# EAGLE design PiDGC (EAGLE 9.6.2)
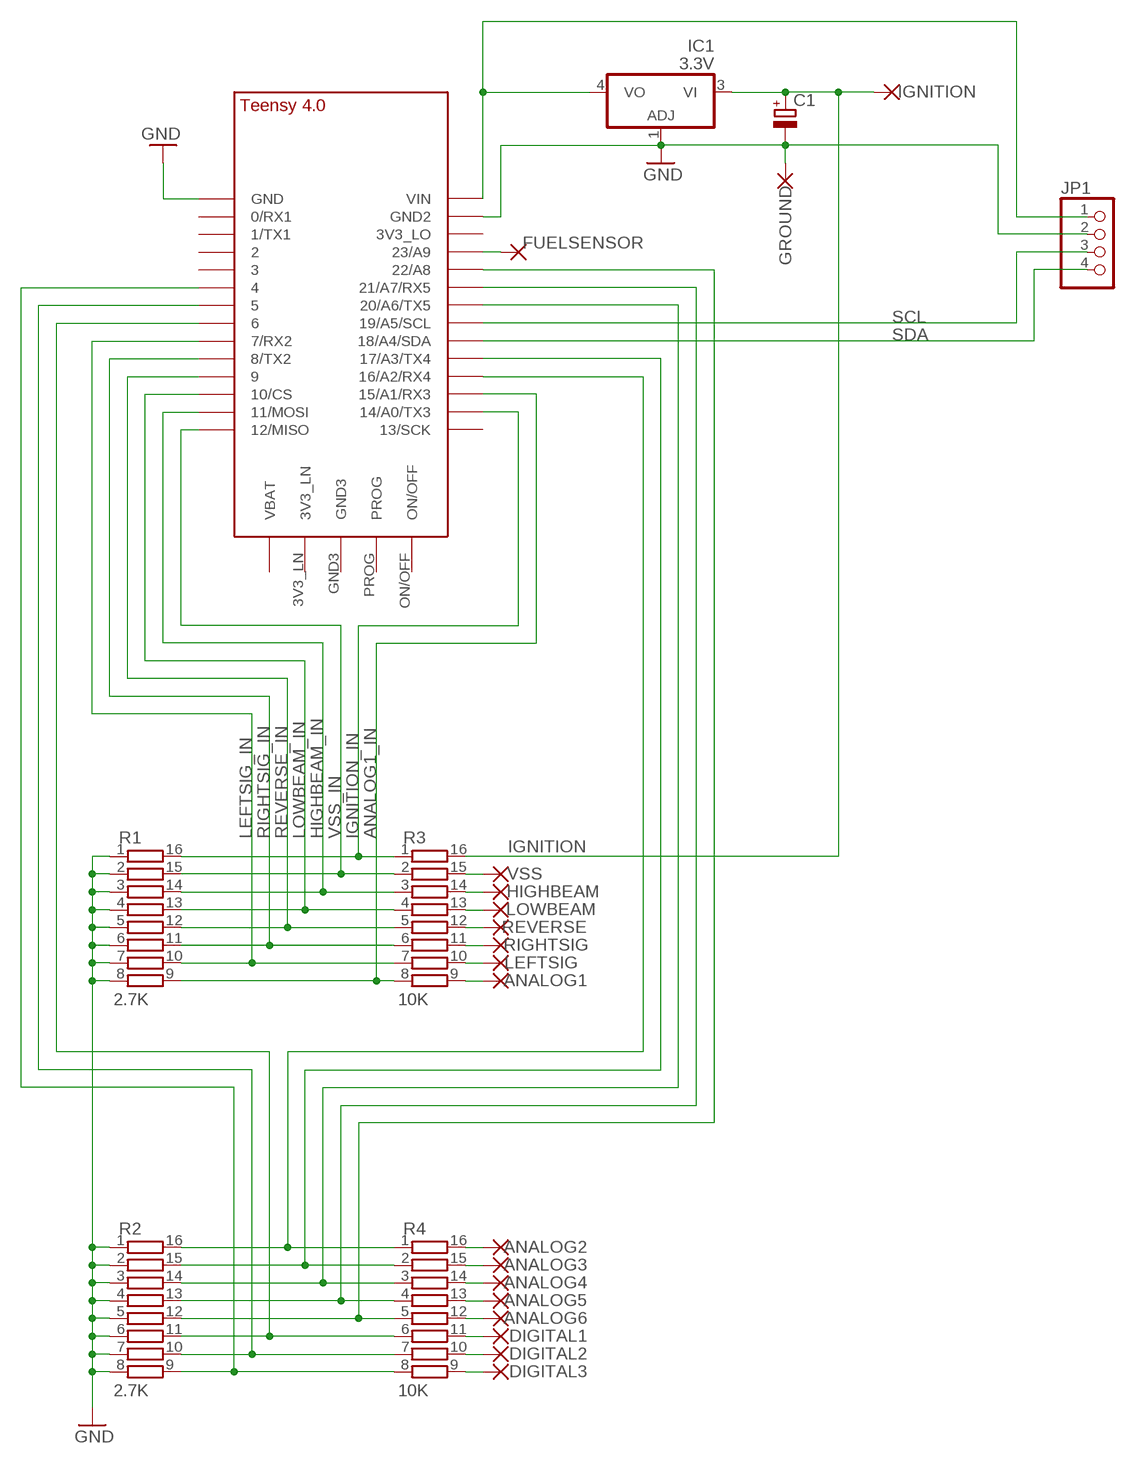
[diagram p0: schematic, sheet 1]

## Parts
ANALOG1  WIREPAD3,81/1,4  [3,81/1,4]
ANALOG2  WIREPAD3,81/1,4  [3,81/1,4]
ANALOG3  WIREPAD3,81/1,4  [3,81/1,4]
ANALOG4  WIREPAD3,81/1,4  [3,81/1,4]
ANALOG5  WIREPAD3,81/1,4  [3,81/1,4]
ANALOG6  WIREPAD3,81/1,4  [3,81/1,4]
C1  CPOL-EUE7.5-16  [E7,5-16]
DIGITAL1  WIREPAD3,81/1,4  [3,81/1,4]
DIGITAL2  WIREPAD3,81/1,4  [3,81/1,4]
DIGITAL3  WIREPAD3,81/1,4  [3,81/1,4]
FUELSENSOR  WIREPAD3,81/1,4  [3,81/1,4]
GROUND  WIREPAD3,81/1,4  [3,81/1,4]
HIGHBEAM  WIREPAD3,81/1,4  [3,81/1,4]
IC1  3.3V  317EMP  [SOT223]
IGNITION  WIREPAD3,81/1,4  [3,81/1,4]
JP1  PINHD-1X4  [1X04]
LEFTSIG  WIREPAD3,81/1,4  [3,81/1,4]
LOWBEAM  WIREPAD3,81/1,4  [3,81/1,4]
R1  2.7K  2NBS16-8  [SO16]
R2  2.7K  2NBS16-8  [SO16]
R3  10K  2NBS16-8  [SO16]
R4  10K  2NBS16-8  [SO16]
REVERSE  WIREPAD3,81/1,4  [3,81/1,4]
RIGHTSIG  WIREPAD3,81/1,4  [3,81/1,4]
U$1  TEENSY_4.0  [TEENSY_4.0]
VSS  WIREPAD3,81/1,4  [3,81/1,4]

## Nets
ANALOG1_IN: R1.9 R3.8 U$1.15/A1(15/A1/RX3)
GND: C1.- GROUND.1(P) IC1.1(ADJ) JP1.2 R1.1 R1.2 R1.3 R1.4 R1.5 R1.6 R1.7 R1.8 R2.1 R2.2 R2.3 R2.4 R2.5 R2.6 R2.7 R2.8 U$1.GND U$1.GND2
HIGHBEAM_IN: R1.14 R3.3 U$1.11/MOSI
IGNITION: C1.+ IC1.3(VI) IGNITION.1(P) R3.16
IGNITION_IN: R1.16 R3.1 U$1.14/A0(14/A0/TX3)
LEFTSIG_IN: R1.10 R3.7 U$1.7(7/RX2)
LOWBEAM_IN: R1.13 R3.4 U$1.10/CS
N$1: IC1.4(VO) JP1.1 U$1.VIN
N$11: R2.16 R4.1 U$1.16/A2(16/A2/RX4)
N$12: R2.15 R4.2 U$1.17/A3(17/A3/TX4)
N$13: R2.14 R4.3 U$1.20/A6(20/A6/TX5)
N$14: R2.13 R4.4 U$1.21/A7(21/A7/RX5)
N$15: R2.12 R4.5 U$1.22/A8
N$16: R2.11 R4.6 U$1.6
N$17: R2.10 R4.7 U$1.5
N$18: R2.9 R4.8 U$1.4/CANRX
N$19: R3.15 VSS.1(P)
N$20: HIGHBEAM.1(P) R3.14
N$21: LOWBEAM.1(P) R3.13
N$22: R3.12 REVERSE.1(P)
N$23: R3.11 RIGHTSIG.1(P)
N$24: LEFTSIG.1(P) R3.10
N$25: ANALOG1.1(P) R3.9
N$26: ANALOG2.1(P) R4.16
N$27: ANALOG3.1(P) R4.15
N$28: ANALOG4.1(P) R4.14
N$29: ANALOG5.1(P) R4.13
N$30: ANALOG6.1(P) R4.12
N$31: DIGITAL1.1(P) R4.11
N$32: DIGITAL2.1(P) R4.10
N$33: DIGITAL3.1(P) R4.9
N$34: FUELSENSOR.1(P) U$1.23/A9
REVERSE_IN: R1.12 R3.5 U$1.9/CS
RIGHTSIG_IN: R1.11 R3.6 U$1.8(8/TX2)
SCL: JP1.3 U$1.19/A5/SCL
SDA: JP1.4 U$1.18/A4/SDA
VSS_IN: R1.15 R3.2 U$1.12/MISO
Unconnected: U$1.0/RX(0/RX1) U$1.1/TX(1/TX1) U$1.2 U$1.3/CANTX U$1.3V3_LN U$1.3V3_LO U$1.13/SCK U$1.GND3 U$1.ON/OFF U$1.PROG U$1.VBAT\(VBAT)

## Library data of the parts
ANALOG1-ANALOG6 DIGITAL1-DIGITAL3 FUELSENSOR GROUND HIGHBEAM IGNITION LEFTSIG LOWBEAM REVERSE RIGHTSIG VSS = wirepad:WIREPAD: Wire PAD connect wire on PCB
C1 = rcl:CPOL-EU: POLARIZED CAPACITOR, European symbol; SPICEPREFIX: C
IC1 = linear:*317: Positive VOLTAGE REGULATOR
JP1 = pinhead:PINHD-1X4: PIN HEADER
R1-R4 = resistor-bourns:2NBS16-8: BOURNS RESISTOR NETWORK; OC_FARNELL: unknown; OC_NEWARK: unknown
U$1 = TEENSY 4.0:TEENSY_4.0

## Board
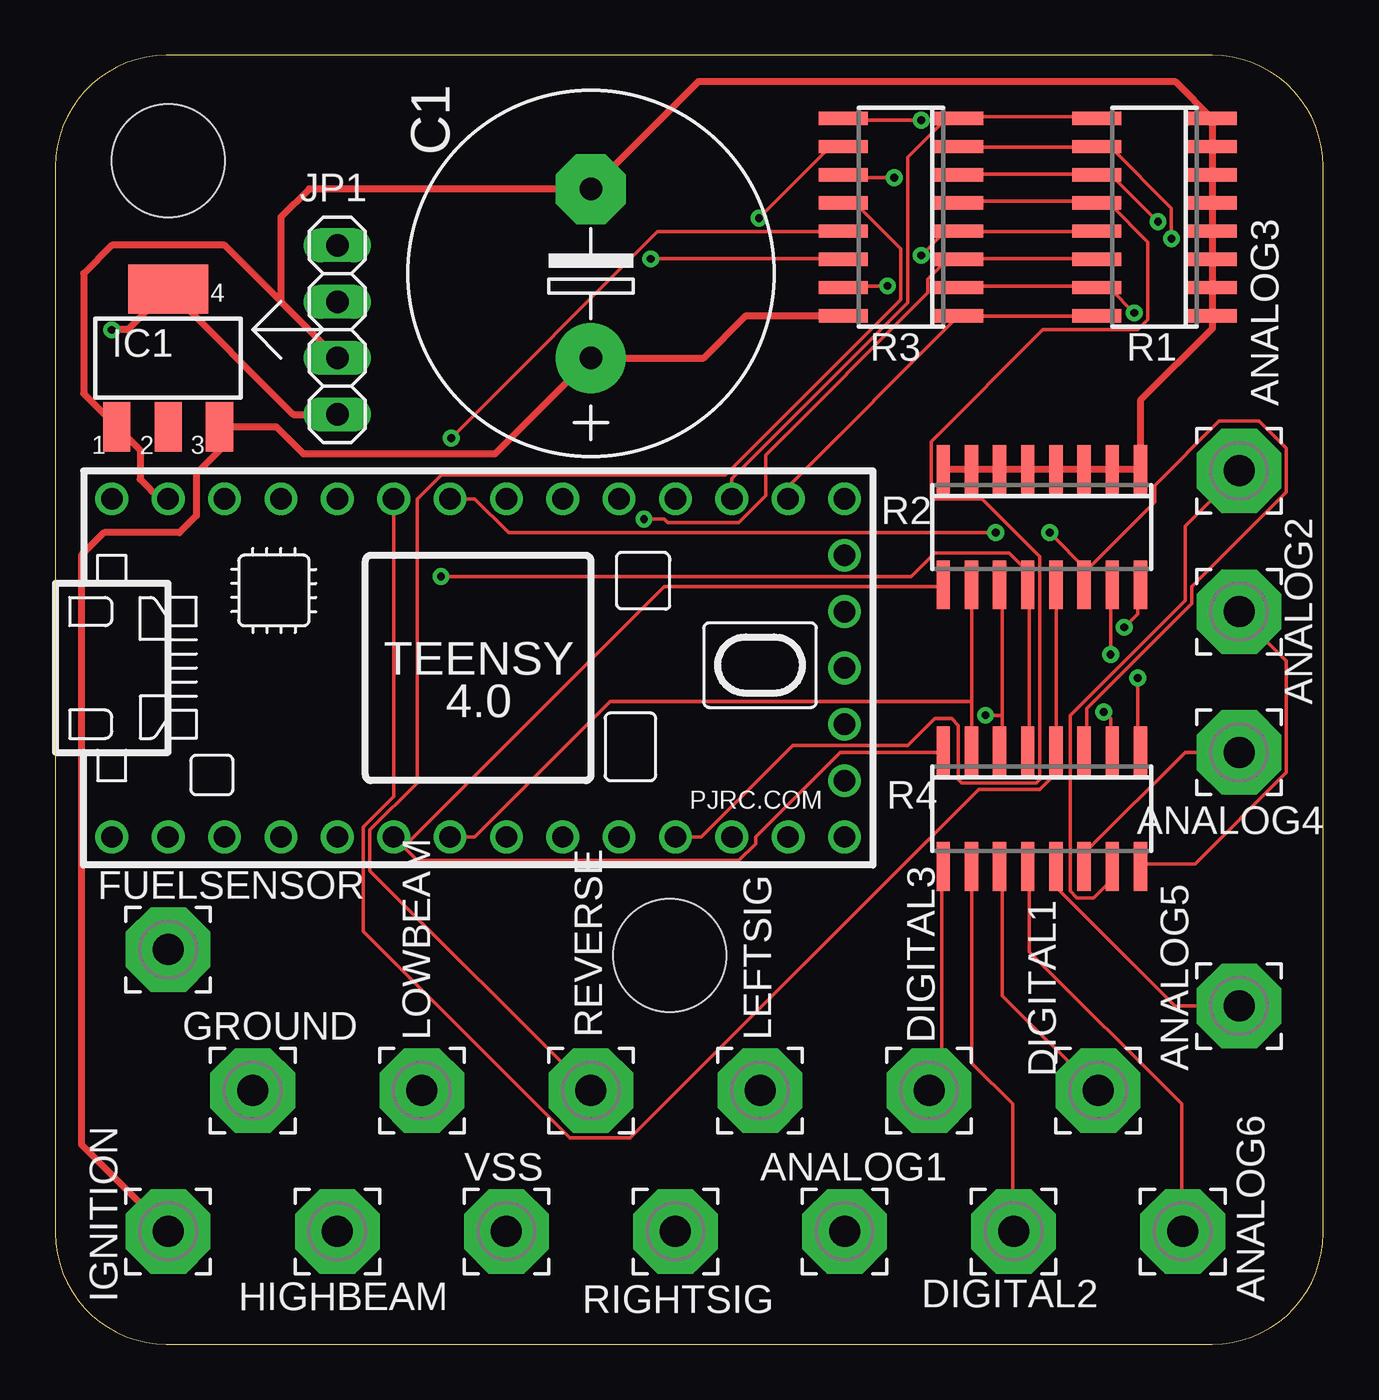
[diagram p1: board, top side]
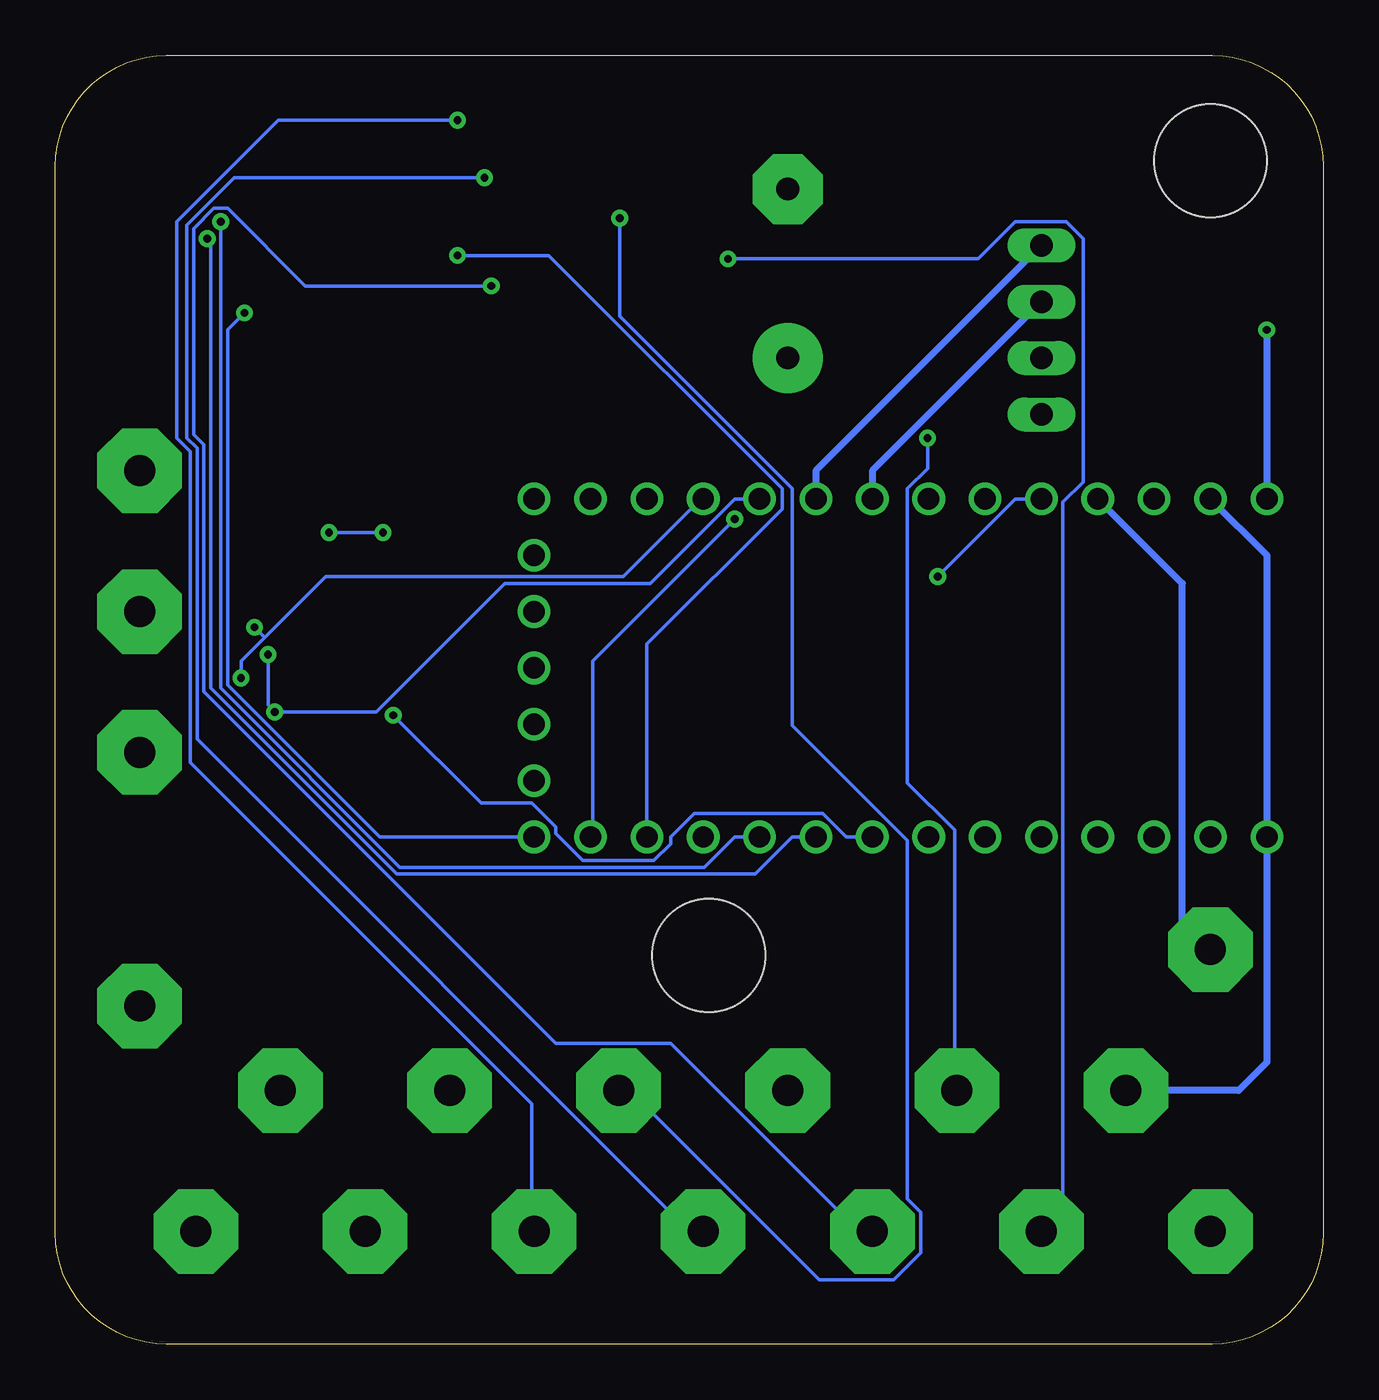
[diagram p2: board, bottom side, seen from below]

Size 57.13 x 58.09 mm. Coordinates in mm from the lower left corner, seen from the top.
Outline: 0,53.09 0,5 arc90 5,0 52.13,0 arc90 57.13,5 57.13,53.09 arc90 52.13,58.09 5,58.09 arc90 0,53.09
Copper layers (1*16): Top 0.035mm / dielectric 1.5mm / Bottom 0.035mm
Design rules "default": minimum track width 6mil, minimum drill 0.35mm, track to track 6mil, track to pad 6mil, pad to pad 6mil, via to via 6mil, smd to smd 6mil, copper to edge 40mil, drill to drill 6mil, minimum pad ring 10mil, minimum via ring 8mil, stop-mask expansion 4mil, vias tented up to drill 0mil, thermal gap 10mil
Holes 5.08 mm at 5.08,53.34 27.69,17.53

### Footprints (pad centres in the part's own frame; a part is rotated, then mirrored left to right if it is on the bottom)
3,81/1,4 = drill 1.397 pad 3.81 octagon: 1 0,0
E7,5-16 = drill 1.016 pad 3.15: + -3.81,0 | drill 1.016 pad 3.15 octagon: - 3.81,0
SOT223 = smd 1.219 x 2.235: 1 -2.311,-3.099; 2 0,-3.099; 3 2.311,-3.099 | smd 3.6 x 2.2: 4 0,3.099
1X04 = drill 1.016 long: 1 -3.81,0; 2 -1.27,0; 3 1.27,0; 4 3.81,0
SO16 = smd 0.6 x 2.2: 1 -4.445,-2.6; 2 -3.175,-2.6; 3 -1.905,-2.6; 4 -0.635,-2.6; 5 0.635,-2.6; 6 1.905,-2.6; 7 3.175,-2.6; 8 4.445,-2.6; 9 4.445,2.6; 10 3.175,2.6; 11 1.905,2.6; 12 0.635,2.6; 13 -0.635,2.6; 14 -1.905,2.6; 15 -3.175,2.6; 16 -4.445,2.6
TEENSY_4.0 = drill 0.965: 0/RX -13.97,-7.62; 1/TX -11.43,-7.62; 2 -8.89,-7.62; 3/CANTX -6.35,-7.62; 3V3_LN 16.51,-2.54; 3V3_LO -11.43,7.62; 4/CANRX -3.81,-7.62; 5 -1.27,-7.62; 6 1.27,-7.62; 7 3.81,-7.62; 8 6.35,-7.62; 9/CS 8.89,-7.62; 10/CS 11.43,-7.62; 11/MOSI 13.97,-7.62; 12/MISO 16.51,-7.62; 13/SCK 16.51,7.62; 14/A0 13.97,7.62; 15/A1 11.43,7.62; 16/A2 8.89,7.62; 17/A3 6.35,7.62; 18/A4/SDA 3.81,7.62; 19/A5/SCL 1.27,7.62; 20/A6 -1.27,7.62; 21/A7 -3.81,7.62; 22/A8 -6.35,7.62; 23/A9 -8.89,7.62; GND -16.51,-7.62; GND2 -13.97,7.62; GND3 16.51,0; ON/OFF 16.51,5.08; PROG 16.51,2.54; VBAT\ 16.51,-5.08; VIN -16.51,7.62

### Placement (x,y rotation side)
ANALOG1  35.56,5.08 0 top
ANALOG2  53.34,33.02 0 top
ANALOG3  53.34,39.37 0 top
ANALOG4  53.34,26.67 0 top
ANALOG5  53.34,15.24 0 top
ANALOG6  50.8,5.08 0 top
C1  24.13,48.26 90 top
DIGITAL1  46.99,11.43 0 top
DIGITAL2  43.18,5.08 0 top
DIGITAL3  39.37,11.43 0 top
FUELSENSOR  5.08,17.78 0 top
GROUND  8.89,11.43 0 top
HIGHBEAM  12.7,5.08 0 top
IC1  5.08,44.45 0 top
IGNITION  5.08,5.08 0 top
JP1  12.7,45.72 90 top
LEFTSIG  31.75,11.43 0 top
LOWBEAM  16.51,11.43 0 top
R1  49.53,50.8 90 top
R2  44.45,36.83 180 top
R3  38.1,50.8 90 top
R4  44.45,24.13 180 top
REVERSE  24.13,11.43 0 top
RIGHTSIG  27.94,5.08 0 top
U$1  19.05,30.48 0 top
VSS  20.32,5.08 0 top

### Tracks (layer width: path | path; a pad name or v marks a point on that pad's centre or on a via)
ANALOG1_IN
  Top 0.152: R1.9 46.79,55.32 40.84,55.32 R3.8 40.69,55.17 40.08,55.17 38.41,53.49 38.41,46.94 30.48,39.01 U$1.15/A1
GND
  Top 0.305: U$1.GND2 4.7,38.1 3.81,38.99 3.81,40.31 IC1.1 1.27,42.85 1.27,48.26 2.54,49.53 7.62,49.53 JP1.2 10.16,46.99 10.16,50.8 11.43,52.07 C1.- 28.98,56.92 50.45,56.92 R1.8 R1.7 R1.6 R1.5 R1.4 R1.3 R1.2 R1.1 52.13,45.78 48.9,42.55 R2.1 R2.2 R2.3 R2.4 R2.5 R2.6 R2.7 R2.8
  Bottom 0.305: U$1.GND2 2.54,35.56 U$1.GND 2.54,12.7 3.81,11.43 GROUND.1
HIGHBEAM_IN  (via drill 0.35)
  Top 0.152: R1.14 46.79,48.92 40.84,48.92 R3.3 40.69,48.77 40.08,48.77 39.32,48.01 39.32,47.4 32,40.08 32,38.25 30.79,37.03 27.58,37.03 27.43,37.19 v26.52,37.19
  Bottom 0.152: v26.52,37.19 32.92,30.79 32.92,22.86 U$1.11/MOSI
IGNITION
  Top 0.305: R3.16 31.11,46.35 29.21,44.45 C1.+ 19.81,40.13 11.18,40.13 9.96,41.35 IC1.3 7.39,40.28 6.35,39.24 6.35,37.34 5.59,36.58 2.18,36.58 1.17,35.56 1.17,8.99 IGNITION.1
IGNITION_IN
  Top 0.152: R1.16 46.79,46.33 40.84,46.33 R3.1 40.69,46.33 33.07,38.71 33.07,38.1 U$1.14/A0
LEFTSIG_IN  (via drill 0.35)
  Top 0.152: R3.7 40.84,53.95 46.79,53.95 R1.10 46.94,53.95 47.55,53.95 50.29,51.21 v50.29,49.84
  Bottom 0.152: U$1.7 23.93,22.86 25.6,21.18 41.76,21.18 50.14,29.57 50.14,49.68 v50.29,49.84
LOWBEAM_IN  (via drill 0.35)
  Top 0.152: R1.13 46.79,50.14 40.84,50.14 R3.4 40.69,50.14 40.08,50.14 v39.01,49.07
  Bottom 0.152: U$1.10/CS 30.48,31.55 24.38,37.64 24.38,38.56 34.9,49.07 v39.01,49.07
N$1  (via drill 0.35)
  Top 0.305: JP1.1 10.72,41.91 IC1.4 3.25,45.72 v2.54,45.72
  Bottom 0.305: v2.54,45.72 U$1.VIN
N$11  (via drill 0.35)
  Top 0.152: v48.77,30.02 48.77,26.82 R4.1 | v48.16,32.31 48.77,32.92 48.77,34.14 R2.16
  Bottom 0.152: v48.77,30.02 48.77,30.79 47.7,31.85 | 47.7,31.85 44.96,34.59 31.55,34.59 28.04,38.1 U$1.16/A2 | 47.7,31.85 v48.16,32.31
N$12  (via drill 0.35)
  Top 0.152: v47.24,28.5 47.55,28.19 47.55,26.82 R4.2 | v47.55,31.09 47.55,34.14 R2.15
  Bottom 0.152: U$1.17/A3 26.52,38.1 30.33,34.29 36.88,34.29 42.67,28.5 v47.24,28.5 47.55,28.8 v47.55,31.09
N$13  (via drill 0.35)
  Top 0.152: 46.48,34.9 49.53,37.95 49.53,38.71 52.43,41.6 54.25,41.6 55.47,40.39 55.47,38.41 51.21,34.14 51.21,33.38 46.48,28.65 46.48,26.82 R4.3 | 46.48,34.9 46.48,34.29 R2.14 46.48,34.9 | U$1.20/A6 18.9,38.1 20.42,36.58 v42.37,36.58 | 46.48,34.9 v44.81,36.58
  Bottom 0.152: v44.81,36.58 v42.37,36.58
N$14
  Top 0.152: R2.13 45.11,34.14 45.11,26.82 R4.4 44.96,26.67 44.96,25.6 44.35,24.99 41.6,24.99 25.91,9.3 23.16,9.3 13.87,18.59 13.87,23.32 15.24,24.69 U$1.21/A7
N$15  (via drill 0.35)
  Top 0.152: R4.5 43.89,26.82 43.89,34.14 R2.12 43.74,34.29 43.74,34.9 42.98,35.66 39.62,35.66 38.56,34.59 v17.37,34.59
  Bottom 0.152: U$1.22/A8 13.87,38.1 v17.37,34.59
N$16  (via drill 0.35)
  Top 0.152: 42.67,28.35 42.67,34.14 R2.11 | 42.67,28.35 42.67,26.82 R4.6 | 42.67,28.35 v41.91,28.35
  Bottom 0.152: U$1.6 21.49,22.86 22.55,23.93 28.35,23.93 29.41,22.86 29.41,22.55 30.18,21.79 33.38,21.79 34.59,23.01 34.59,23.32 35.66,24.38 37.95,24.38 v41.91,28.35
N$17
  Top 0.152: 41.3,28.96 41.3,34.14 R2.10 | 41.3,28.96 41.3,26.82 R4.7 | U$1.5 18.9,22.86 24.99,28.96 41.3,28.96
N$18
  Top 0.152: 15.7,22.4 16.31,21.79 30.79,21.79 31.55,22.55 31.55,22.86 35.36,26.67 39.93,26.67 R4.8 | 15.7,22.4 27.43,34.14 39.93,34.14 R2.9 | 15.7,22.4 U$1.4/CANRX
N$19  (via drill 0.35)
  Top 0.152: v37.49,47.7 35.51,47.7 R3.15
  Bottom 0.152: v37.49,47.7 45.87,47.7 49.38,51.21 49.99,51.21 50.9,50.29 50.9,41 50.44,40.54 50.44,29.41 34.59,13.56 29.41,13.56 21.03,5.18 20.42,5.18 VSS.1
N$20  (via drill 0.35)
  Top 0.152: v26.82,48.92 35.36,48.92 R3.14
  Bottom 0.152: v26.82,48.92 15.54,48.92 13.87,50.6 11.58,50.6 10.82,49.84 10.82,38.86 11.73,37.95 11.73,6.1 12.65,5.18 HIGHBEAM.1
N$21  (via drill 0.35)
  Top 0.152: v17.83,40.84 27.13,50.14 35.36,50.14 R3.13
  Bottom 0.152: v17.83,40.84 17.83,39.47 18.75,38.56 18.75,25.3 16.61,23.16 16.61,11.43 LOWBEAM.1
N$22
  Top 0.152: R3.12 35.51,51.36 36.12,51.36 38.1,49.38 38.1,47.09 30.18,39.17 17.37,39.17 16.31,38.1 16.31,25.3 14.17,23.16 14.17,21.34 24.08,11.43 REVERSE.1
N$23  (via drill 0.35)
  Top 0.152: v37.8,52.58 35.51,52.58 R3.11
  Bottom 0.152: v37.8,52.58 49.07,52.58 51.21,50.44 51.21,40.84 50.75,40.39 50.75,27.28 28.65,5.18 28.04,5.18 RIGHTSIG.1
N$24  (via drill 0.35)
  Top 0.152: v31.7,50.75 34.9,53.95 35.36,53.95 R3.10
  Bottom 0.152: v31.7,50.75 31.7,46.33 23.93,38.56 23.93,27.89 18.75,22.71 18.75,6.55 18.14,5.94 18.14,4.12 19.36,2.9 22.71,2.9 31.24,11.43 LEFTSIG.1
N$25  (via drill 0.35)
  Top 0.152: v39.01,55.17 35.51,55.17 R3.9
  Bottom 0.152: v39.01,55.17 47.09,55.17 51.66,50.6 51.66,40.84 51.05,40.23 51.05,26.21 35.66,10.82 35.66,5.18 ANALOG1.1
N$26
  Top 0.152: R4.16 48.92,21.64 51.36,21.64 55.47,25.76 55.47,30.79 53.34,32.92 ANALOG2.1
N$27
  Top 0.152: R4.15 47.55,21.49 47.55,20.88 46.79,20.12 46.02,20.12 45.72,20.42 45.72,28.35 50.9,33.53 50.9,36.88 53.34,39.32 ANALOG3.1
N$28
  Top 0.152: ANALOG4.1 50.9,26.67 46.48,22.25 46.48,21.64 R4.14
N$29
  Top 0.152: ANALOG5.1 50.44,15.24 45.11,20.57 45.11,21.49 R4.13
N$30
  Top 0.152: R4.12 43.89,21.49 43.89,17.68 50.75,10.82 50.75,5.18 ANALOG6.1
N$31
  Top 0.152: R4.11 42.67,21.49 42.67,15.7 46.94,11.43 DIGITAL1.1
N$32
  Top 0.152: R4.10 41.3,21.49 41.3,12.65 43.13,10.82 43.13,5.18 DIGITAL2.1
N$33
  Top 0.152: R4.9 39.93,21.49 39.93,11.89 39.47,11.43 DIGITAL3.1
N$34
  Bottom 0.305: FUELSENSOR.1 6.35,19.05 6.35,34.29 U$1.23/A9
REVERSE_IN
  Top 0.152: R3.5 40.84,51.51 46.79,51.51 R1.12 46.94,51.36 47.55,51.36 49.23,49.68 49.23,46.18 48.77,45.72 44.5,45.72 39.47,40.69 39.47,38.1 41.76,38.1 44.35,35.51 44.35,25.45 44.2,25.3 40.84,25.3 40.69,25.45 40.69,27.89 40.39,28.19 39.62,28.19 38.41,26.98 33.22,26.98 29.11,22.86 U$1.9/CS
RIGHTSIG_IN  (via drill 0.35)
  Top 0.152: R3.6 40.84,52.73 46.79,52.73 R1.11 46.94,52.58 47.7,52.58 v49.68,50.6
  Bottom 0.152: U$1.8 26.52,22.86 27.89,21.49 41.6,21.49 49.68,29.57 v49.68,50.6
SCL
  Bottom 0.305: JP1.3 20.32,39.37 U$1.19/A5/SCL
SDA
  Bottom 0.305: JP1.4 22.86,39.37 U$1.18/A4/SDA
VSS_IN  (via drill 0.35)
  Top 0.152: R3.2 40.84,47.7 46.79,47.7 R1.15 46.94,47.55 47.55,47.55 v48.62,46.48
  Bottom 0.152: U$1.12/MISO 42.52,22.86 49.38,29.72 49.38,45.72 v48.62,46.48